# EAGLE design WORKSHOP (EAGLE 9.5.1)
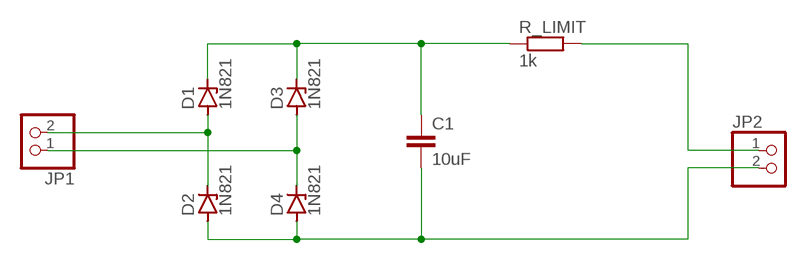
[diagram p0: schematic, sheet 1]

## Parts
C1  10uF  C2.5/6  [C2.5-6]
D1  1N821  [DO35Z10]
D2  1N821  [DO35Z10]
D3  1N821  [DO35Z10]
D4  1N821  [DO35Z10]
JP1  PINHD-1X2  [1X02]
JP2  PINHD-1X2  [1X02]
R_LIMIT  1k  R-EU_0207/12  [0207/12]

## Nets
N$1: JP2.1 R_LIMIT.2
N$2: D1.A D2.C JP1.2
N$3: C1.2 D2.A D4.A JP2.2
N$4: C1.1 D1.C D3.C R_LIMIT.1
N$5: D3.A D4.C JP1.1

## Library data of the parts
C1 = capacitor-wima:C: CAPACITOR naming: grid - package width
D1-D4 = diode:1N821: Reference DIODE temperature compensated, 6,2 V
JP1 JP2 = pinhead:PINHD-1X2: PIN HEADER
R_LIMIT = rcl:R-EU_: RESISTOR, European symbol; SPICEPREFIX: R

## Board
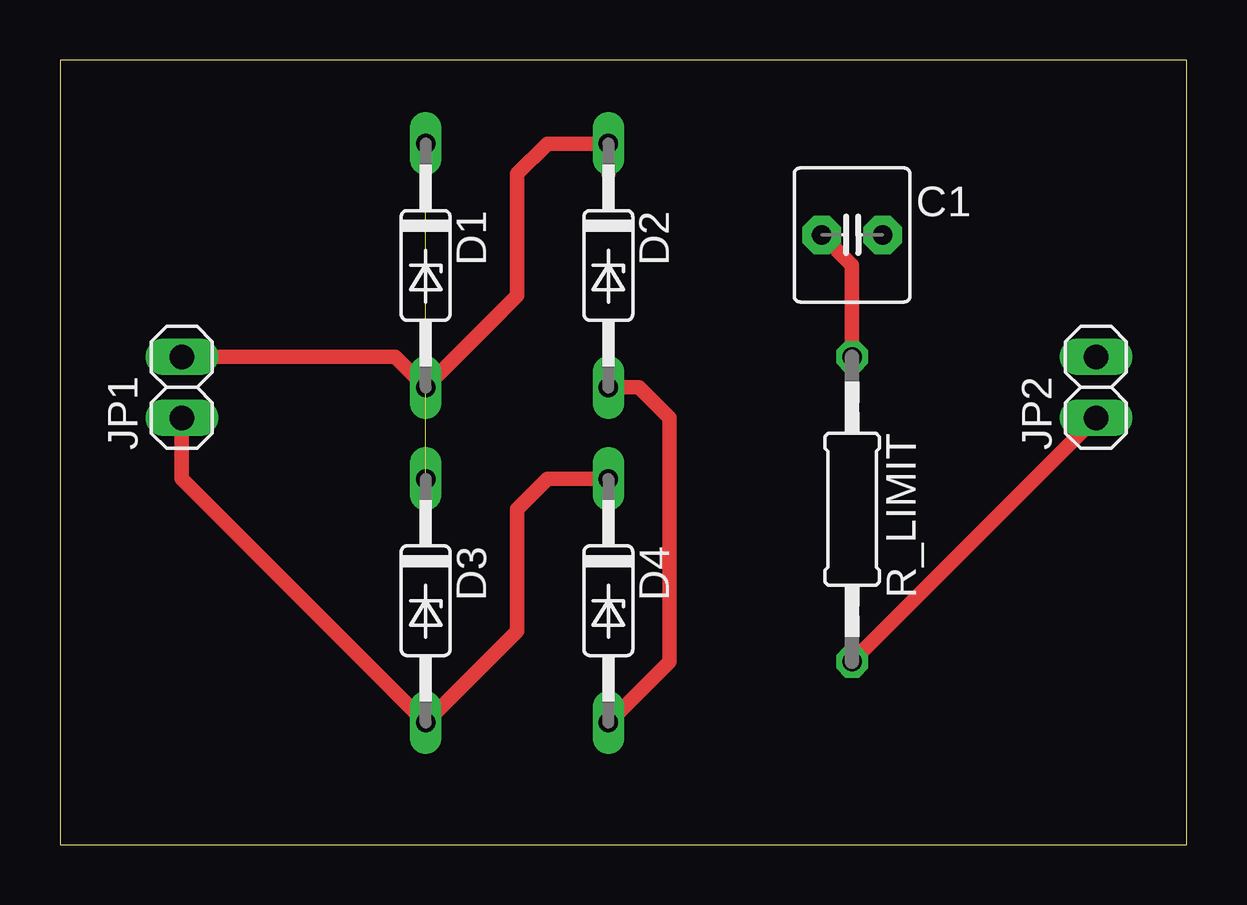
[diagram p1: board, top side]
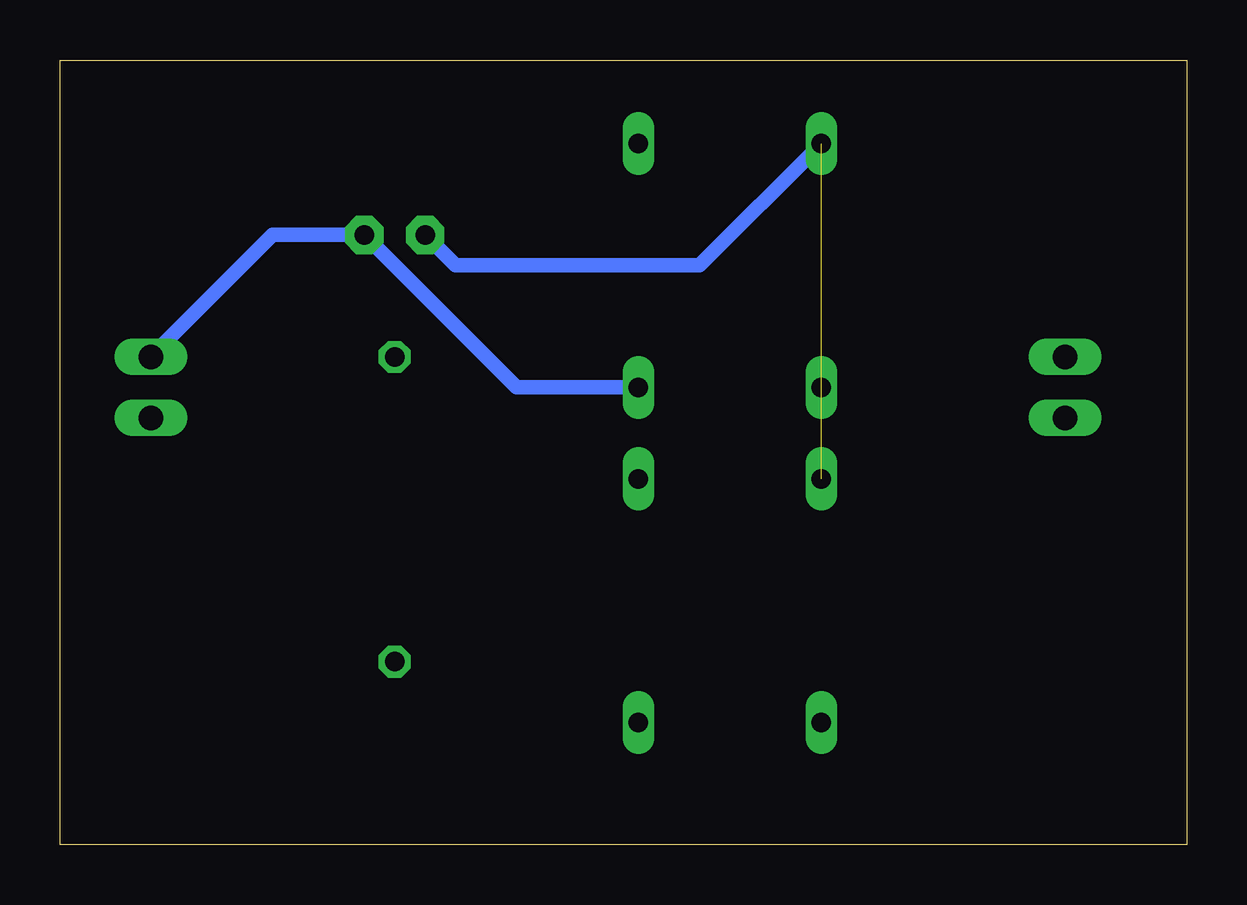
[diagram p2: board, bottom side, seen from below]

Size 46.97 x 32.69 mm. Coordinates in mm from the lower left corner, seen from the top.
Outline: 0,0 46.97,0 46.97,32.69 0,32.69 0,0
Copper layers (1*16): Top 0.035mm / dielectric 1.5mm / Bottom 0.035mm
Design rules "default": minimum track width 6mil, minimum drill 0.35mm, track to track 6mil, track to pad 6mil, pad to pad 6mil, via to via 6mil, smd to smd 6mil, copper to edge 40mil, drill to drill 6mil, minimum pad ring 10mil, minimum via ring 8mil, stop-mask expansion 4mil, vias tented up to drill 0mil, thermal gap 10mil

### Footprints (pad centres in the part's own frame; a part is rotated, then mirrored left to right if it is on the bottom)
C2.5-6 = drill 0.813 pad 1.6 octagon: 1 -1.27,0; 2 1.27,0
DO35Z10 = drill 0.813 long: A 5.08,0; C -5.08,0
1X02 = drill 1.016 long: 1 -1.27,0; 2 1.27,0
0207/12 = drill 0.813 octagon: 1 -6.35,0; 2 6.35,0

### Placement (x,y rotation side)
C1  33.02,25.4 0 top
D1  15.24,24.13 270 top
D2  22.86,24.13 270 top
D3  15.24,10.16 270 top
D4  22.86,10.16 270 top
JP1  5.08,19.05 90 top
JP2  43.18,19.05 90 top
R_LIMIT  33.02,13.97 270 top

### Tracks (layer width: path | path; a pad name or v marks a point on that pad's centre or on a via)
N$1
  Top 0.61: R_LIMIT.2 JP2.1
N$2
  Top 0.61: JP1.2 13.97,20.32 D1.A 19.05,22.86 19.05,27.94 20.32,29.21 D2.C 22.86,27.94
N$3
  Top 0.61: D4.A 25.4,7.62 25.4,17.78 24.13,19.05 D2.A
  Bottom 0.61: JP2.2 38.1,25.4 C1.2 27.94,19.05 D2.A
N$4  (1 unrouted)
  Top 0.61: R_LIMIT.1 33.02,24.13 C1.1
  Bottom 0.61: D1.C 20.32,24.13 30.48,24.13 C1.1
N$5
  Top 0.61: JP1.1 5.08,15.24 D3.A 19.05,8.89 19.05,13.97 20.32,15.24 D4.C